# Altium schematic sheet LED.SchDoc: LED Cube 8x8x8 - LED
size A4; Author: Luka Penger; CompanyName: L. Penger; DrawnBy: Luka Penger; Organization: L. Penger; Address1: Luka Penger; Address2: http://lukapenger.eu; Address3: Software & Hardware; Address4: Development; DocumentNumber: 3; Revision: 1.0.0; SheetNumber: 3; SheetTotal: 4; DocumentName: LED; ProjectName: LED Cube 8x8x8
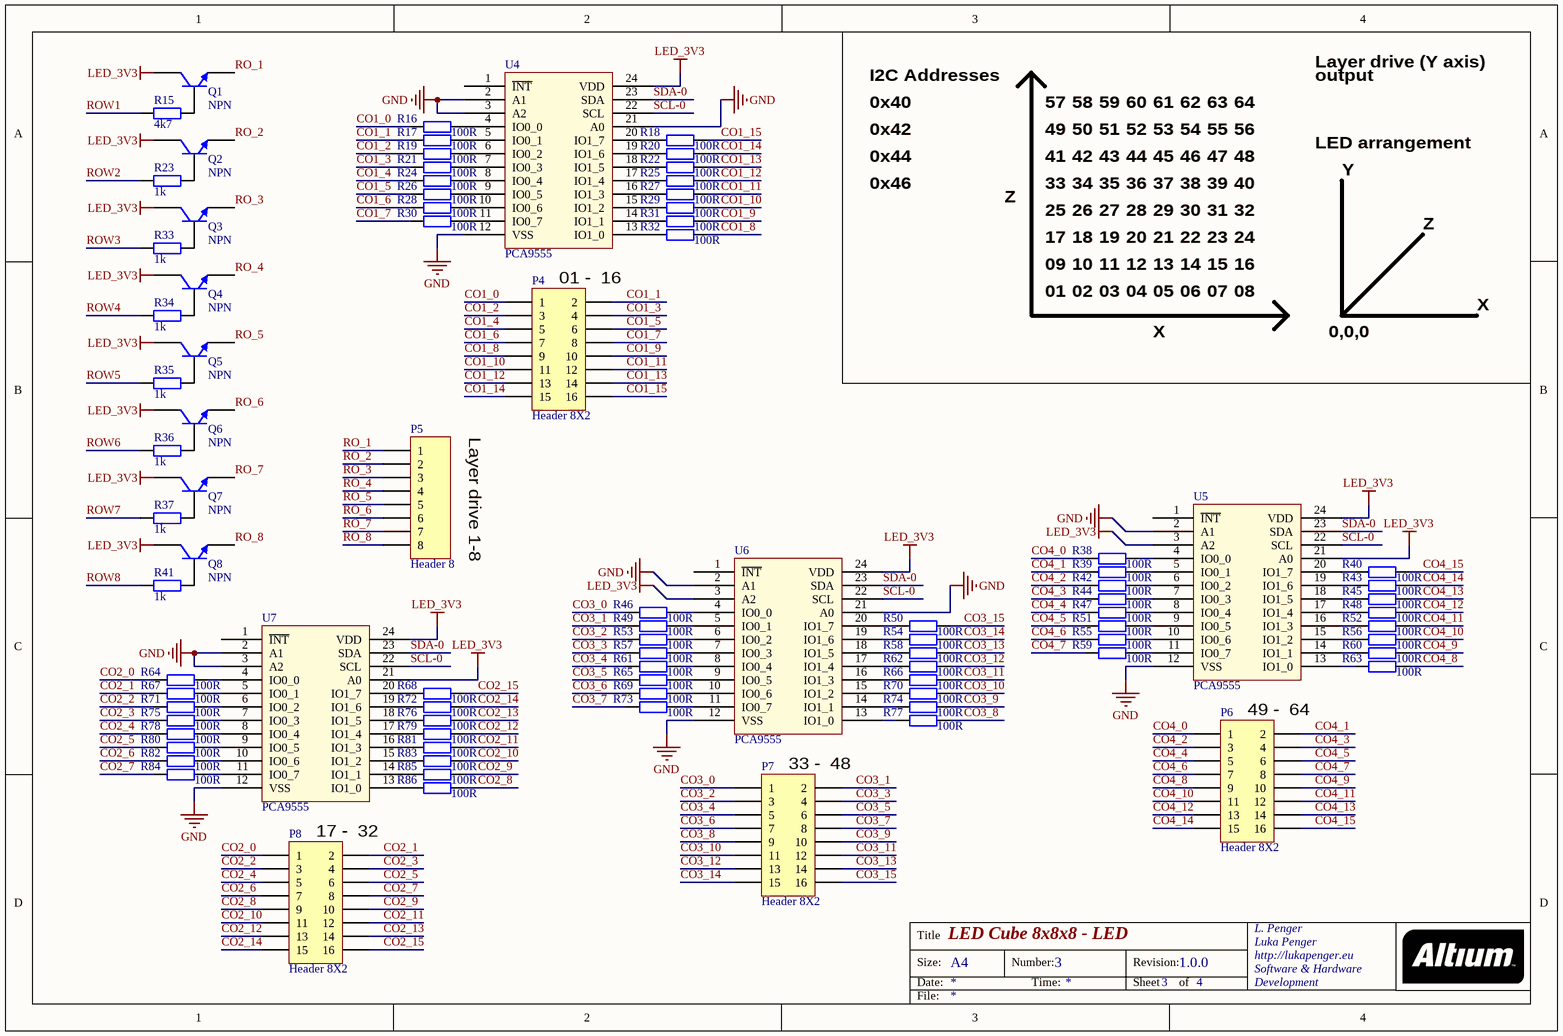
[diagram p0: LED.SchDoc]

## Parts
P4  Header 8X2  [HDR2X8]
P5  Header 8  [HDR1X8]
P6  Header 8X2  [HDR2X8]
P7  Header 8X2  [HDR2X8]
P8  Header 8X2  [HDR2X8]
Q1  NPN  [SOT23_L]
Q2  NPN  [SOT23_L]
Q3  NPN  [SOT23_L]
Q4  NPN  [SOT23_L]
Q5  NPN  [SOT23_L]
Q6  NPN  [SOT23_L]
Q7  NPN  [SOT23_L]
Q8  NPN  [SOT23_L]
R15  4k7  [6-0805_N]
R16  100R  [6-0805_L]
R17  100R  [6-0805_L]
R18  100R  [6-0805_L]
R19  100R  [6-0805_L]
R20  100R  [6-0805_L]
R21  100R  [6-0805_L]
R22  100R  [6-0805_L]
R23  1k  [6-0805_N]
R24  100R  [6-0805_L]
R25  100R  [6-0805_L]
R26  100R  [6-0805_L]
R27  100R  [6-0805_L]
R28  100R  [6-0805_L]
R29  100R  [6-0805_L]
R30  100R  [6-0805_L]
R31  100R  [6-0805_L]
R32  100R  [6-0805_L]
R33  1k  [6-0805_N]
R34  1k  [6-0805_N]
R35  1k  [6-0805_N]
R36  1k  [6-0805_N]
R37  1k  [6-0805_N]
R38  100R  [6-0805_L]
R39  100R  [6-0805_L]
R40  100R  [6-0805_L]
R41  1k  [6-0805_N]
R42  100R  [6-0805_L]
R43  100R  [6-0805_L]
R44  100R  [6-0805_L]
R45  100R  [6-0805_L]
R46  100R  [6-0805_L]
R47  100R  [6-0805_L]
R48  100R  [6-0805_L]
R49  100R  [6-0805_L]
R50  100R  [6-0805_L]
R51  100R  [6-0805_L]
R52  100R  [6-0805_L]
R53  100R  [6-0805_L]
R54  100R  [6-0805_L]
R55  100R  [6-0805_L]
R56  100R  [6-0805_L]
R57  100R  [6-0805_L]
R58  100R  [6-0805_L]
R59  100R  [6-0805_L]
R60  100R  [6-0805_L]
R61  100R  [6-0805_L]
R62  100R  [6-0805_L]
R63  100R  [6-0805_L]
R64  100R  [6-0805_L]
R65  100R  [6-0805_L]
R66  100R  [6-0805_L]
R67  100R  [6-0805_L]
R68  100R  [6-0805_L]
R69  100R  [6-0805_L]
R70  100R  [6-0805_L]
R71  100R  [6-0805_L]
R72  100R  [6-0805_L]
R73  100R  [6-0805_L]
R74  100R  [6-0805_L]
R75  100R  [6-0805_L]
R76  100R  [6-0805_L]
R77  100R  [6-0805_L]
R78  100R  [6-0805_L]
R79  100R  [6-0805_L]
R80  100R  [6-0805_L]
R81  100R  [6-0805_L]
R82  100R  [6-0805_L]
R83  100R  [6-0805_L]
R84  100R  [6-0805_L]
R85  100R  [6-0805_L]
R86  100R  [6-0805_L]
U4  PCA9555  [SSOP24_N]
U5  PCA9555  [SSOP24_N]
U6  PCA9555  [SSOP24_N]
U7  PCA9555  [SSOP24_N]

## Nets
GND: U4.2(A1) U4.3(A2) U4.12(VSS) U4.21(A0) U5.2(A1) U5.12(VSS) U6.2(A1) U6.12(VSS) U6.21(A0) U7.2(A1) U7.3(A2) U7.12(VSS)
LED_3V3: Q1.1(C) Q2.1(C) Q3.1(C) Q4.1(C) Q5.1(C) Q6.1(C) Q7.1(C) Q8.1(C) U4.24(VDD) U5.3(A2) U5.21(A0) U5.24(VDD) U6.3(A2) U6.24(VDD) U7.21(A0) U7.24(VDD)
CO1_0: P4.1 R16.1
CO1_1: P4.2 R17.1
CO1_2: P4.3 R19.1
CO1_3: P4.4 R21.1
CO1_4: P4.5 R24.1
CO1_5: P4.6 R26.1
CO1_6: P4.7 R28.1
CO1_7: P4.8 R30.1
CO1_8: P4.9 R32.2
CO1_9: P4.10 R31.2
CO1_10: P4.11 R29.2
CO1_11: P4.12 R27.2
CO1_12: P4.13 R25.2
CO1_13: P4.14 R22.2
CO1_14: P4.15 R20.2
CO1_15: P4.16 R18.2
CO2_0: P8.1 R64.1
CO2_1: P8.2 R67.1
CO2_2: P8.3 R71.1
CO2_3: P8.4 R75.1
CO2_4: P8.5 R78.1
CO2_5: P8.6 R80.1
CO2_6: P8.7 R82.1
CO2_7: P8.8 R84.1
CO2_8: P8.9 R86.2
CO2_9: P8.10 R85.2
CO2_10: P8.11 R83.2
CO2_11: P8.12 R81.2
CO2_12: P8.13 R79.2
CO2_13: P8.14 R76.2
CO2_14: P8.15 R72.2
CO2_15: P8.16 R68.2
CO3_0: P7.1 R46.1
CO3_1: P7.2 R49.1
CO3_2: P7.3 R53.1
CO3_3: P7.4 R57.1
CO3_4: P7.5 R61.1
CO3_5: P7.6 R65.1
CO3_6: P7.7 R69.1
CO3_7: P7.8 R73.1
CO3_8: P7.9 R77.2
CO3_9: P7.10 R74.2
CO3_10: P7.11 R70.2
CO3_11: P7.12 R66.2
CO3_12: P7.13 R62.2
CO3_13: P7.14 R58.2
CO3_14: P7.15 R54.2
CO3_15: P7.16 R50.2
CO4_0: P6.1 R38.1
CO4_1: P6.2 R39.1
CO4_2: P6.3 R42.1
CO4_3: P6.4 R44.1
CO4_4: P6.5 R47.1
CO4_5: P6.6 R51.1
CO4_6: P6.7 R55.1
CO4_7: P6.8 R59.1
CO4_8: P6.9 R63.2
CO4_9: P6.10 R60.2
CO4_10: P6.11 R56.2
CO4_11: P6.12 R52.2
CO4_12: P6.13 R48.2
CO4_13: P6.14 R45.2
CO4_14: P6.15 R43.2
CO4_15: P6.16 R40.2
RO_1: P5.1 Q1.3(E)
RO_2: P5.2 Q2.3(E)
RO_3: P5.3 Q3.3(E)
RO_4: P5.4 Q4.3(E)
RO_5: P5.5 Q5.3(E)
RO_6: P5.6 Q6.3(E)
RO_7: P5.7 Q7.3(E)
RO_8: P5.8 Q8.3(E)
ROW1: R15.2
ROW2: R23.2
ROW3: R33.2
ROW4: R34.2
ROW5: R35.2
ROW6: R36.2
ROW7: R37.2
ROW8: R41.2
SCL-0: U4.22(SCL) U5.22(SCL) U6.22(SCL) U7.22(SCL)
SDA-0: U4.23(SDA) U5.23(SDA) U6.23(SDA) U7.23(SDA)
NetQ1_2: Q1.2(B) R15.1
NetQ2_2: Q2.2(B) R23.1
NetQ3_2: Q3.2(B) R33.1
NetQ4_2: Q4.2(B) R34.1
NetQ5_2: Q5.2(B) R35.1
NetQ6_2: Q6.2(B) R36.1
NetQ7_2: Q7.2(B) R37.1
NetQ8_2: Q8.2(B) R41.1
NetR16_2: R16.2 U4.4(IO0_0)
NetR17_2: R17.2 U4.5(IO0_1)
NetR18_1: R18.1 U4.20(IO1_7)
NetR19_2: R19.2 U4.6(IO0_2)
NetR20_1: R20.1 U4.19(IO1_6)
NetR21_2: R21.2 U4.7(IO0_3)
NetR22_1: R22.1 U4.18(IO1_5)
NetR24_2: R24.2 U4.8(IO0_4)
NetR25_1: R25.1 U4.17(IO1_4)
NetR26_2: R26.2 U4.9(IO0_5)
NetR27_1: R27.1 U4.16(IO1_3)
NetR28_2: R28.2 U4.10(IO0_6)
NetR29_1: R29.1 U4.15(IO1_2)
NetR30_2: R30.2 U4.11(IO0_7)
NetR31_1: R31.1 U4.14(IO1_1)
NetR32_1: R32.1 U4.13(IO1_0)
NetR38_2: R38.2 U5.4(IO0_0)
NetR39_2: R39.2 U5.5(IO0_1)
NetR40_1: R40.1 U5.20(IO1_7)
NetR42_2: R42.2 U5.6(IO0_2)
NetR43_1: R43.1 U5.19(IO1_6)
NetR44_2: R44.2 U5.7(IO0_3)
NetR45_1: R45.1 U5.18(IO1_5)
NetR46_2: R46.2 U6.4(IO0_0)
NetR47_2: R47.2 U5.8(IO0_4)
NetR48_1: R48.1 U5.17(IO1_4)
NetR49_2: R49.2 U6.5(IO0_1)
NetR50_1: R50.1 U6.20(IO1_7)
NetR51_2: R51.2 U5.9(IO0_5)
NetR52_1: R52.1 U5.16(IO1_3)
NetR53_2: R53.2 U6.6(IO0_2)
NetR54_1: R54.1 U6.19(IO1_6)
NetR55_2: R55.2 U5.10(IO0_6)
NetR56_1: R56.1 U5.15(IO1_2)
NetR57_2: R57.2 U6.7(IO0_3)
NetR58_1: R58.1 U6.18(IO1_5)
NetR59_2: R59.2 U5.11(IO0_7)
NetR60_1: R60.1 U5.14(IO1_1)
NetR61_2: R61.2 U6.8(IO0_4)
NetR62_1: R62.1 U6.17(IO1_4)
NetR63_1: R63.1 U5.13(IO1_0)
NetR64_2: R64.2 U7.4(IO0_0)
NetR65_2: R65.2 U6.9(IO0_5)
NetR66_1: R66.1 U6.16(IO1_3)
NetR67_2: R67.2 U7.5(IO0_1)
NetR68_1: R68.1 U7.20(IO1_7)
NetR69_2: R69.2 U6.10(IO0_6)
NetR70_1: R70.1 U6.15(IO1_2)
NetR71_2: R71.2 U7.6(IO0_2)
NetR72_1: R72.1 U7.19(IO1_6)
NetR73_2: R73.2 U6.11(IO0_7)
NetR74_1: R74.1 U6.14(IO1_1)
NetR75_2: R75.2 U7.7(IO0_3)
NetR76_1: R76.1 U7.18(IO1_5)
NetR77_1: R77.1 U6.13(IO1_0)
NetR78_2: R78.2 U7.8(IO0_4)
NetR79_1: R79.1 U7.17(IO1_4)
NetR80_2: R80.2 U7.9(IO0_5)
NetR81_1: R81.1 U7.16(IO1_3)
NetR82_2: R82.2 U7.10(IO0_6)
NetR83_1: R83.1 U7.15(IO1_2)
NetR84_2: R84.2 U7.11(IO0_7)
NetR85_1: R85.1 U7.14(IO1_1)
NetR86_1: R86.1 U7.13(IO1_0)

Not connected (* = marked no-connect by the designer): U4 1(~{INT}); U5 1(~{INT}); U6 1(~{INT}); U7 1(~{INT})

## Notes on the sheet
- I2C Addresses
- 0x40
- 57
- 58
- 59
- 60
- 61
- 62
- 63
- 64
- Layer drive (Y axis)
- output
- 0x42
- 0x44
- 41
- 49
- 42
- 50
- 43
- 51
- 44
- 52
- 45
- 53
- 46
- 54
- 47
- 55
- 48
- 56
- LED arrangement
- Y
- 0x46
- Z
- 17
- 25
- 33
- 18
- 26
- 34
- 19
- 27
- 35
- 20
- 28
- 36
- 21
- 29
- 37
- 22
- 30
- 38
- 23
- 31
- 39
- 24
- 32
- 40
- (near P4) 01 -  16
- 01
- 09
- 02
- 10
- 03
- 11
- 04
- 12
- 05
- 13
- 06
- 14
- 07
- 15
- 08
- 16
- X
- 0,0,0
- Layer drive 1-8
- (near P6) 49 -  64
- (near P7) 33 -  48
- (near P8) 17 -  32
- Title
- Size:
- Date:
- A4
- Number:
- Time:
- Revision:
- Sheet
- of
- File:

## Library data of the parts
P4 P6-P8 = Header 8X2: Header, 8-Pin, Dual row; LatestRevisionDate: 17-Jul-2002; LatestRevisionNote: Re-released for DXP Platform.; Publisher: Altium Limited
P5 = Header 8: Header, 8-Pin; LatestRevisionDate: 17-Jul-2002; LatestRevisionNote: Re-released for DXP Platform.; Publisher: Altium Limited
Q1-Q8 = NPN: NPN Bipolar Transistor; Published: 8-Jun-2000; LatestRevisionDate: 17-Jul-2002; LatestRevisionNote: Re-released for DXP Platform.; PackageReference: TO-226-AA; Publisher: Altium Limited; PackageDescription: TO, Flat Index; 3 In-Line, Axial Leads; Body Dia. 4.8mm; Leads 0.55 x 0.51 mm (max); Code_JEDEC: TO-226-AA
R15-R22 R24-R32 R38-R40 R42-R86 = Res2: Resistor; Value: 1K; Published: 8-Jun-2000; LatestRevisionDate: 17-Jul-2002; LatestRevisionNote: Re-released for DXP Platform.; PackageReference: AXIAL-0.4; Publisher: Altium Limited; PackageDescription: Axial Device, Thru-Hole; 2 Leads; 0.4 in Pin Spacing
R23 R33-R37 R41 = Res2: Resistor; Published: 8-Jun-2000; LatestRevisionDate: 17-Jul-2002; LatestRevisionNote: Re-released for DXP Platform.; PackageReference: AXIAL-0.4; Publisher: Altium Limited; PackageDescription: Axial Device, Thru-Hole; 2 Leads; 0.4 in Pin Spacing; Value: 1K
U4-U7 = PCA9555: I2C I/O Ports